# EAGLE design WillowModule_v1 (EAGLE 7.3.0)
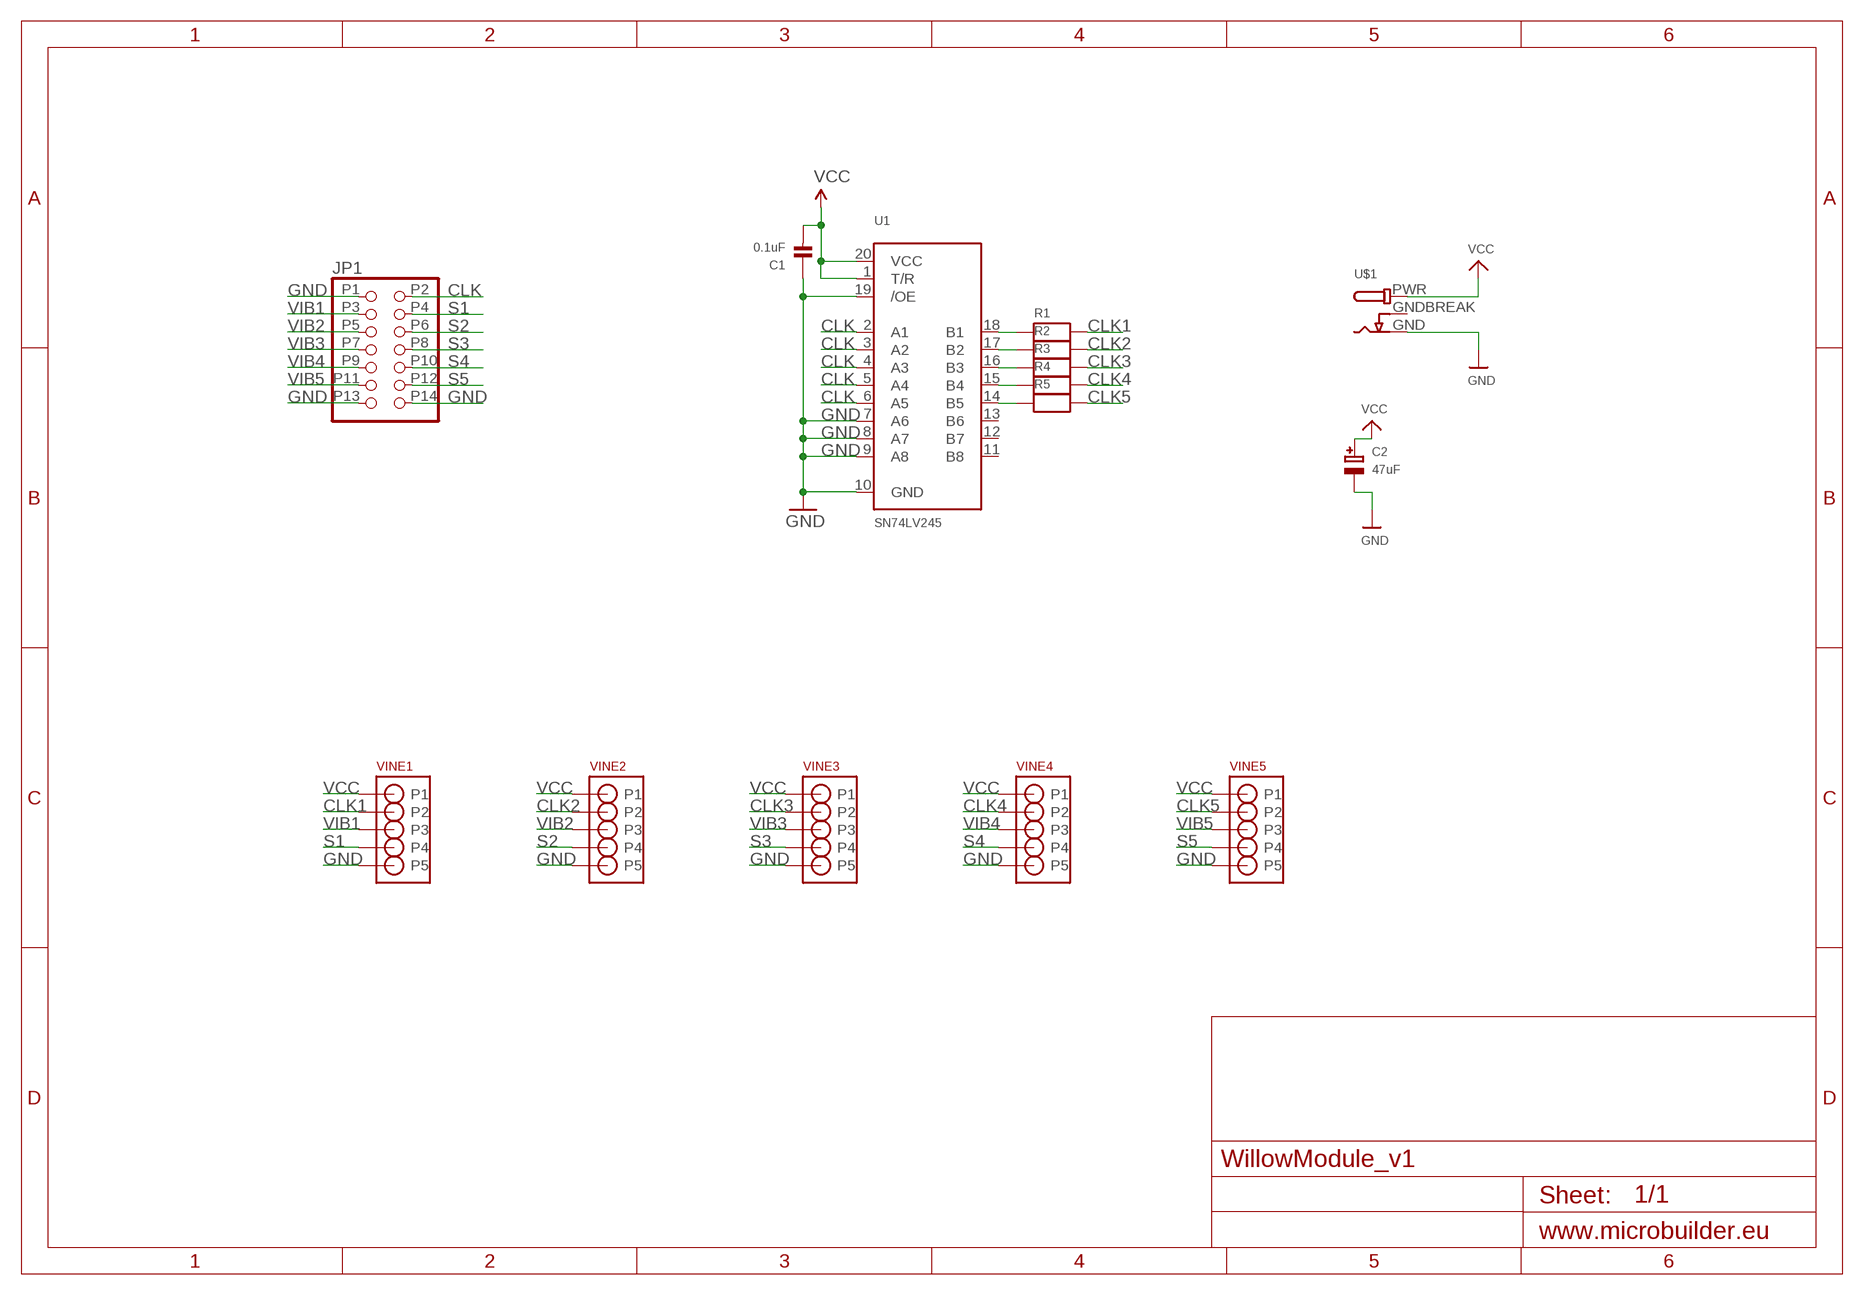
[diagram p0: schematic, sheet 1]

## Parts
C1  0.1uF  CAP_CERAMIC0603  [0603]
C2  47uF  CAP_ELECTROLYTICPANASONIC_C  [PANASONIC_C]
JP1  IDC-BOX-HEADER  [IDC-BOX-HEADER]
R1  RESISTOR0603  [0603]
R2  RESISTOR0603  [0603]
R3  RESISTOR0603  [0603]
R4  RESISTOR0603  [0603]
R5  RESISTOR0603  [0603]
U1  SN74LV245  74LCX245  [TSSOP20]
U$1  DC-POWER-JACK-3PIN  [PJ-050AH]
VINE1  DIN-5PIN-180SDS-50J  [SDS-50J]
VINE2  DIN-5PIN-180SDS-50J  [SDS-50J]
VINE3  DIN-5PIN-180SDS-50J  [SDS-50J]
VINE4  DIN-5PIN-180SDS-50J  [SDS-50J]
VINE5  DIN-5PIN-180SDS-50J  [SDS-50J]

## Nets
5V: C1.2 U1.1(T/R) U1.20(VCC) ; supply symbol labelled VCC
CLK: JP1.P2 U1.2(A1) U1.3(A2) U1.4(A3) U1.5(A4) U1.6(A5)
CLK1: R1.2 VINE1.P2
CLK2: R2.2 VINE2.P2
CLK3: R3.2 VINE3.P2
CLK4: R4.2 VINE4.P2
CLK5: R5.2 VINE5.P2
GND: C1.1 C2.- JP1.P1 JP1.P13 JP1.P14 U1.7(A6) U1.8(A7) U1.9(A8) U1.10(GND) U1.19(/OE) U$1.GND VINE1.P5 VINE2.P5 VINE3.P5 VINE4.P5 VINE5.P5
N$23: R1.1 U1.18(B1)
N$24: R2.1 U1.17(B2)
N$25: R3.1 U1.16(B3)
N$26: R4.1 U1.15(B4)
N$27: R5.1 U1.14(B5)
S1: JP1.P4 VINE1.P4
S2: JP1.P6 VINE2.P4
S3: JP1.P8 VINE3.P4
S4: JP1.P10 VINE4.P4
S5: JP1.P12 VINE5.P4
VCC: C2.+ U$1.PWR VINE1.P1 VINE2.P1 VINE3.P1 VINE4.P1 VINE5.P1
VIB1: JP1.P3 VINE1.P3
VIB2: JP1.P5 VINE2.P3
VIB3: JP1.P7 VINE3.P3
VIB4: JP1.P9 VINE4.P3
VIB5: JP1.P11 VINE5.P3
Unconnected: U1.11(B8) U1.12(B7) U1.13(B6)

## Power pins joined to a net without a drawn wire
GNDBREAK: U$1.GNDBREAK

## Library data of the parts
C1 = microbuilder:CAP_CERAMIC: Ceramic Capacitors 0402 - 0402 Surface Mount Capacitors 16pF 50V 5% [Digikey: 445-4899-2-ND] 18pF 50V 5% [Digikey: 490-1281-2-ND] 22pF 50V 5% [Digikey: 490-1283-2-ND] 68pF 50V 5% [Digikey: 490-1289-2-ND] 0.1uF 10V 10% [Digikey: 490-1318-2-ND] 1.0uF 6.3V 10% [Digikey: 490-1320-2-ND] 0603 - 0603 Surface Mount Capacitors 16 pF 50V 5% [Digikey: 445-5051-2-ND] 22 pF 50V [Digikey: PCC220ACVTR-ND] 33 pF 50V 5% [Digikey: 490-1415-1-ND] 56pF 50V 5% [Digikey: 490-1421-1-ND] 220pF 50V 5% [Digikey: 445-1285-1-ND] 680 pF 50V 2200 pF 50V 5% C0G [Digikey: 445-1297-1-ND] 5600 pF 100V 5% X7R [Digikey: 478-3711-1-ND] 0.1 µF 25V 10% [Digikey: PCC2277TR-ND] 0.22 µF 16V 10% X7R [Digikey: 445-1318-1-ND] 1.0 µF 25V 10% [Digikey: 445-5146-2-ND] 0603 - RF Specific 3pF 250V +/-0.1pF RF [Digikey: 712-1347-1-ND] 18 pF 250V 5% [Digikey: 478-3505-1-ND or 712-1322-1-ND] 56 pF 250V 5% C0G RF [Digikey: 490-4867-1-ND] 68 pF 250V RF [Digikey: 490-4868-1-ND] 0805 - 0805 Surface Mount Capacitors 220 pF 250V 2% RF Ceramic Capacitor [Digikey: 712-1398-1-ND] 1000 pF 50V 2% NP0 Ceramic Capacitor [Digikey: 478-3760-1-ND] 0.1 µF 25V 10% Ceramic Capacitor [Digikey: PCC1828TR-ND] 1.0 µF 16V 10% Ceramic Capacitor[Digikey: 490-1691-2-ND] 10.0 µF 10V 10% Ceramic Capacitor[Digikey: 709-1228-1-ND] 10.0 uF 16V 10% Ceramic Capacitor [Digikey: 478-5165-2-ND] 47 uF 6.3V 20% Ceramic Capacitor [Digikey: 587-1779-1-ND or 399-5506-1-ND] 1206 - 1206 Surface Mount Capacitors 47uF 10V 20% Ceramic Capacitor [Digikey: 490-5528-1-ND or 399-5508-1-ND or 445-6010-1-ND] 100uF 6.3V -20%, +80% Y5V Ceramic Capacitor (Digikey: 490-4512-1-ND, Mouser: 81-GRM31CF50J107ZE1L)
C2 = microbuilder:CAP_ELECTROLYTIC: Electrolytic Capacitors SMT PANASONIC_C - Size C Panasonic Electrolytic Aluminum Capacitor 47µF 16V 20% Electrolytic Capacitor [Digikey: PCE3890TR-ND] PANASONIC_D - Size D Panasonic Electrolytic Aluminum Capacitor 100µF 25V 20% Electrolytic Capacitor [Digikey: PCE3898TR-ND] PTH 3.5 mm grid, 8 mm diameter ... 3.5 mm grid, 10 mm diameter ...
JP1 = Custom:IDC-BOX-HEADER
R1-R5 = microbuilder:RESISTOR: Resistors 0402 - 0402 Surface Mount Package 22 Ohm 1% 1/16W [Digikey: 311-22.0LRTR-ND] 33 Ohm 5% 1/16W 1.0K 5% 1/16W 1.5K 5% 1/16W 2.0K 1% 1/16W 10.0K 1% 1/16W [Digikey: 311-10.0KLRTR-ND] 10.0K 5% 1/16W [Digikey: RMCF0402JT10K0TR-ND] 12.1K 1% 1/16W [Digikey: 311-22.0LRTR-ND] 100.0K 5% 1/16W 0603 - 0603 Surface Mount Package 0 Ohm 1/10 Watt 1% Resistor 15 Ohm 1/10 Watt 1% Resistor 33 Ohm 1/10 Watt 1% Resistor 49.9 Ohm 1/10 Watt 1% Resistor 100 Ohm 1/10 Watt 1% Resistor 150 Ohm 1/10 Watt 1% Resistor 240 Ohm 1/10 Watt 1% Resistor 390 Ohm 1/10 Watt 1% Resistor 560 Ohm 1/10 Watt 1% Resistor 680 Ohm 1/10 Watt 1% Resistor 750 Ohm 1/10 Watt 1% Resistor 1.0K Ohm 1/10 Watt 1% Resistor 1.5K Ohm 1/10 Watt 1% Resistor 2.0K Ohm 1/10 Watt 1% Resistor 2.2K Ohm 1/10 Watt 1% Resistor 3.3K Ohm 1/10 Watt 1% Resistor 4.7K Ohm 1/10 Watt 1% Resistor 10.0K Ohm 1/10 Watt 1% Resistor 12.0K Ohm 1/10 Watt 1% Resistor 12.1K Ohm 1/10 Watt 1% Resistor 20.0K Ohm 1/10 Watt 1% Resistor 33.0K Ohm 1/10 Watt 1% Resistor 100.0K Ohm 1/10 Watt 1% Resistor 0805 - 0805 Surface Mount Package 0 Ohm 1/8 Watt 1% Resistor 33 Ohm 1/8 Watt 1% Resistor 100 Ohm 1/8 Watt 1% Resistor 150 Ohm 1/8 Watt 1% Resistor 200 Ohm 1/8 Watt 1% Resistor 240 Ohm 1/8 Watt 1% Resistor 330 Ohm 1/8 Watt 1% Resistor 390 Ohm 1/8 Watt 1% Resistor 470 Ohm 1/8 Watt 1% Resistor 1.0K Ohm 1/8 Watt 1% Resistor 1.5K Ohm 1/8 Watt 1% Resistor 2.0K Ohm 1/8 Watt 1% Resistor 4.7K Ohm 1/8 Watt 1% Resistor 5.1K Ohm 1/8 Watt 1% Resistor 5.6K Ohm 1/8 Watt 1% Resistor 10.0K Ohm 1/8 Watt 1% Resistor 22.0K Ohm 1/8 Watt 1% Resistor 33.0K Ohm 1/8 Watt 1% Resistor 100K Ohm 1/8 Watt 1% Resistor 1206 - 1206 Surface Mount Package 2012 - 2010 Surface Mount Package 0.11 Ohm 1/2 Watt 1% Resistor - Digikey: RHM.11UCT-ND
U1 = microbuilder:74LCX245: 74LCX245MTC - 5.0V Tolerant Bi-Directional Buffer Can be used to interface 5.0V logic to 2.5 or 3.3V devices Digikey: 74LCX245MTCXTR-ND Mouser: 512-74LCX245MTCX
U$1 = Custom:DC-POWER-JACK-3PIN
VINE1-VINE5 = Custom:DIN-5PIN-180

## Board
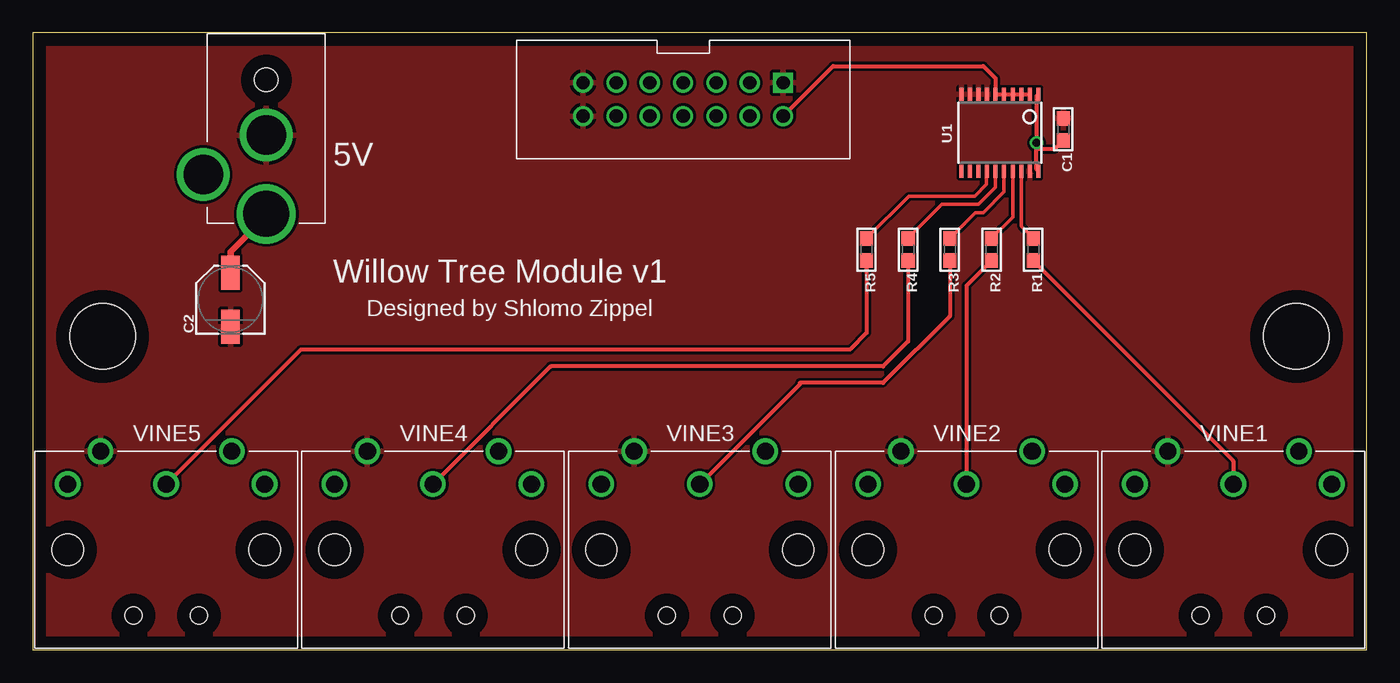
[diagram p1: board, top side]
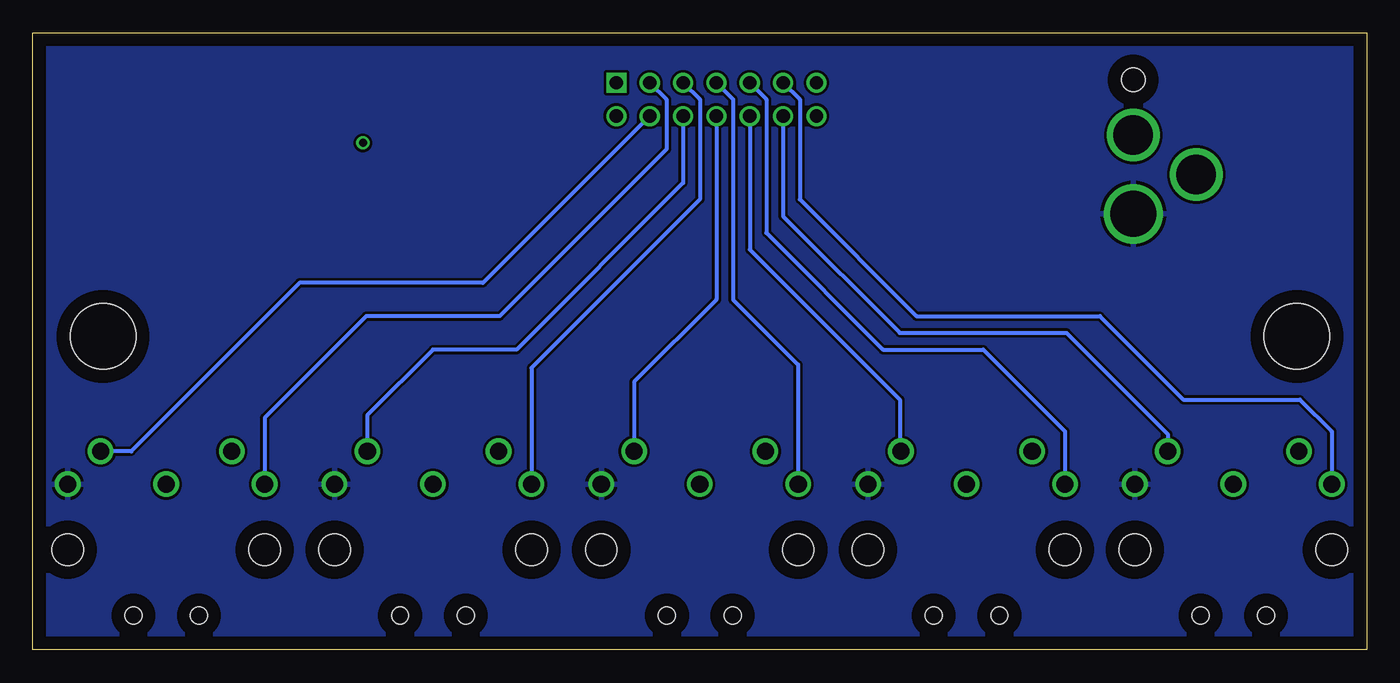
[diagram p2: board, bottom side, seen from below]

Size 101.6 x 46.98 mm. Coordinates in mm from the lower left corner, seen from the top.
Outline: 0,0 101.6,0 101.6,46.98 0,46.98 0,0
Copper layers (1*16): Top 0.035mm / dielectric 1.5mm / Bottom 0.035mm
Design rules "default": minimum track width 10mil, minimum drill 24mil, track to track 8mil, track to pad 8mil, pad to pad 8mil, via to via 8mil, smd to smd 8mil, copper to edge 40mil, drill to drill 8mil, minimum pad ring 10mil, minimum via ring 8mil, stop-mask expansion 4mil, vias tented up to drill 0mil, thermal gap 10mil
Holes 5 mm at 5.31,23.86 96.25,23.86

### Footprints (pad centres in the part's own frame; a part is rotated, then mirrored left to right if it is on the bottom)
0603 = smd 1.1 x 1: 1 -0.85,0; 2 0.85,0
PANASONIC_C = smd 2.6 x 1.4: + 2.05,0; - -2.05,0
IDC-BOX-HEADER = drill 1.02 square: P1 -7.62,-1.27 | drill 1.02: P2 -7.62,1.27; P3 -5.08,-1.27; P4 -5.08,1.27; P5 -2.54,-1.27; P6 -2.54,1.27; P7 0,-1.27; P8 0,1.27; P9 2.54,-1.27; P10 2.54,1.27; P11 5.08,-1.27; P12 5.08,1.27; P13 7.62,-1.27; P14 7.62,1.27
TSSOP20 = smd 0.305 x 0.991: 1 -2.925,-2.918; 2 -2.275,-2.918; 3 -1.625,-2.918; 4 -0.975,-2.918; 5 -0.325,-2.918; 6 0.325,-2.918; 7 0.975,-2.918; 8 1.625,-2.918; 9 2.275,-2.918; 10 2.925,-2.918; 11 2.925,2.918; 12 2.275,2.918; 13 1.625,2.918; 14 0.975,2.918; 15 0.325,2.918; 16 -0.325,2.918; 17 -0.975,2.918; 18 -1.625,2.918; 19 -2.275,2.918; 20 -2.925,2.918
PJ-050AH = drill 3: GND -3,0; GNDBREAK 0,-4.8 | drill 3.5: PWR 3,0 | hole 1.8: -7.2,0
SDS-50J = drill 1.3: P1 7.5,5; P2 0,5; P3 -7.5,5; P4 5,7.5; P5 -5,7.5 | hole 2.4: -7.5,0; 7.5,0 | hole 1.3: -2.5,-5; 2.5,-5

### Placement (x,y rotation side)
C1  78.49,39.62 270 top
C2  15.06,26.66 90 top
JP1  49.53,41.91 180 top
R1  76.2,30.48 270 top
R2  73.03,30.48 270 top
R3  69.85,30.48 270 top
R4  66.67,30.48 270 top
R5  63.5,30.48 270 top
U1  73.66,39.37 180 top
U$1  17.78,36.2 270 top
VINE1  91.44,7.62 0 top
VINE2  71.12,7.62 0 top
VINE3  50.8,7.62 0 top
VINE4  30.48,7.62 0 top
VINE5  10.16,7.62 0 top

### Tracks (layer width: path | path; a pad name or v marks a point on that pad's centre or on a via)
5V  (via drill 0.6)
  Top 0.305: U1.20 76.45,36.58 76.45,38.1 | 76.45,38.1 v76.45,38.61 76.45,42.16 U1.1 | C1.2 77.81,38.1 76.45,38.1
CLK
  Top 0.254: 73.41,42.29 75.31,42.29 | U1.3 75.31,42.29 | 75.31,42.29 75.82,42.29
  Top 0.305: U1.2 U1.3 U1.4 U1.5 U1.6 73.33,43.51 72.39,44.45 60.96,44.45 JP1.P2
CLK1
  Top 0.305: R1.2 91.44,14.39 VINE1.P2
CLK2
  Top 0.305: R2.2 71.12,27.73 VINE2.P2
CLK3
  Top 0.305: R3.2 69.85,25.4 64.77,20.32 58.42,20.32 58.42,20.24 VINE3.P2
CLK4
  Top 0.305: R4.2 66.67,23.5 64.77,21.59 39.45,21.59 VINE4.P2
CLK5
  Top 0.305: R5.2 63.5,24.13 62.23,22.86 20.4,22.86 VINE5.P2
GND
  pour Top: 0,46.99 101.6,46.99 101.6,0 0,0
N$23
  Top 0.254: U1.18 75.28,32.24 R1.1
N$24
  Top 0.254: U1.17 74.64,32.94 R2.1
N$25
  Top 0.254: U1.16 73.98,34.87 72.39,33.27 71.79,33.27 R3.1
N$26
  Top 0.254: U1.15 73.33,35.23 72.01,33.91 69.25,33.91 R4.1
N$27
  Top 0.254: U1.14 72.64,36.41 72.64,35.43 71.75,34.54 66.71,34.54 R5.1
S1
  Bottom 0.305: JP1.P4 67.31,27.94 81.28,27.94 94.1,15.12 VINE1.P4
S2
  Bottom 0.305: JP1.P6 52.07,35.56 64.77,22.86 71.12,22.86 76.12,17.86 VINE2.P4
S3
  Bottom 0.305: JP1.P8 49.53,26.67 55.8,20.4 VINE3.P4
S4
  Bottom 0.305: JP1.P10 46.99,30.48 35.56,19.05 35.56,15.24 35.48,15.16 VINE4.P4
S5
  Bottom 0.305: JP1.P12 44.45,33.02 35.56,24.13 22.86,24.13 15.16,16.43 VINE5.P4
VCC
  Top 0.508: U$1.PWR 17.78,33.02 15.06,30.3 C2.+
  pour Bottom: 0,46.99 101.6,46.99 101.6,0 0,0
VIB1
  Bottom 0.305: JP1.P3 53.34,41.91 53.34,38.1 66.04,25.4 76.2,25.4 83.94,17.66 VINE1.P3
VIB2
  Bottom 0.305: JP1.P5 50.8,41.91 50.8,34.29 63.62,21.47 VINE2.P3
VIB3
  Bottom 0.305: JP1.P7 48.26,41.91 48.26,26.67 43.3,21.71 VINE3.P3
VIB4
  Bottom 0.305: JP1.P9 45.72,41.91 45.72,31.75 36.83,22.86 29.21,22.86 22.98,16.63 VINE4.P3
VIB5
  Bottom 0.305: JP1.P11 43.18,41.91 43.18,34.29 34.29,25.4 20.32,25.4 13.97,19.05 5.08,19.05 2.66,16.63 VINE5.P3

### Text on the board
tPlace: 5V | Willow Tree Module v1 | Designed by Shlomo Zippel